# Altium schematic sheet UNDERLEGS_BULKHEAD.SchDoc: =DocumentName
size A4; Organization: Queen's Formula SAE; Address1: 130 Stuart St, Kingston; Address2: Ontario; Address3: Canada; Address4: K7L 2V9; DocumentNumber: 1; Revision: 0; SheetNumber: 1; SheetTotal: 1
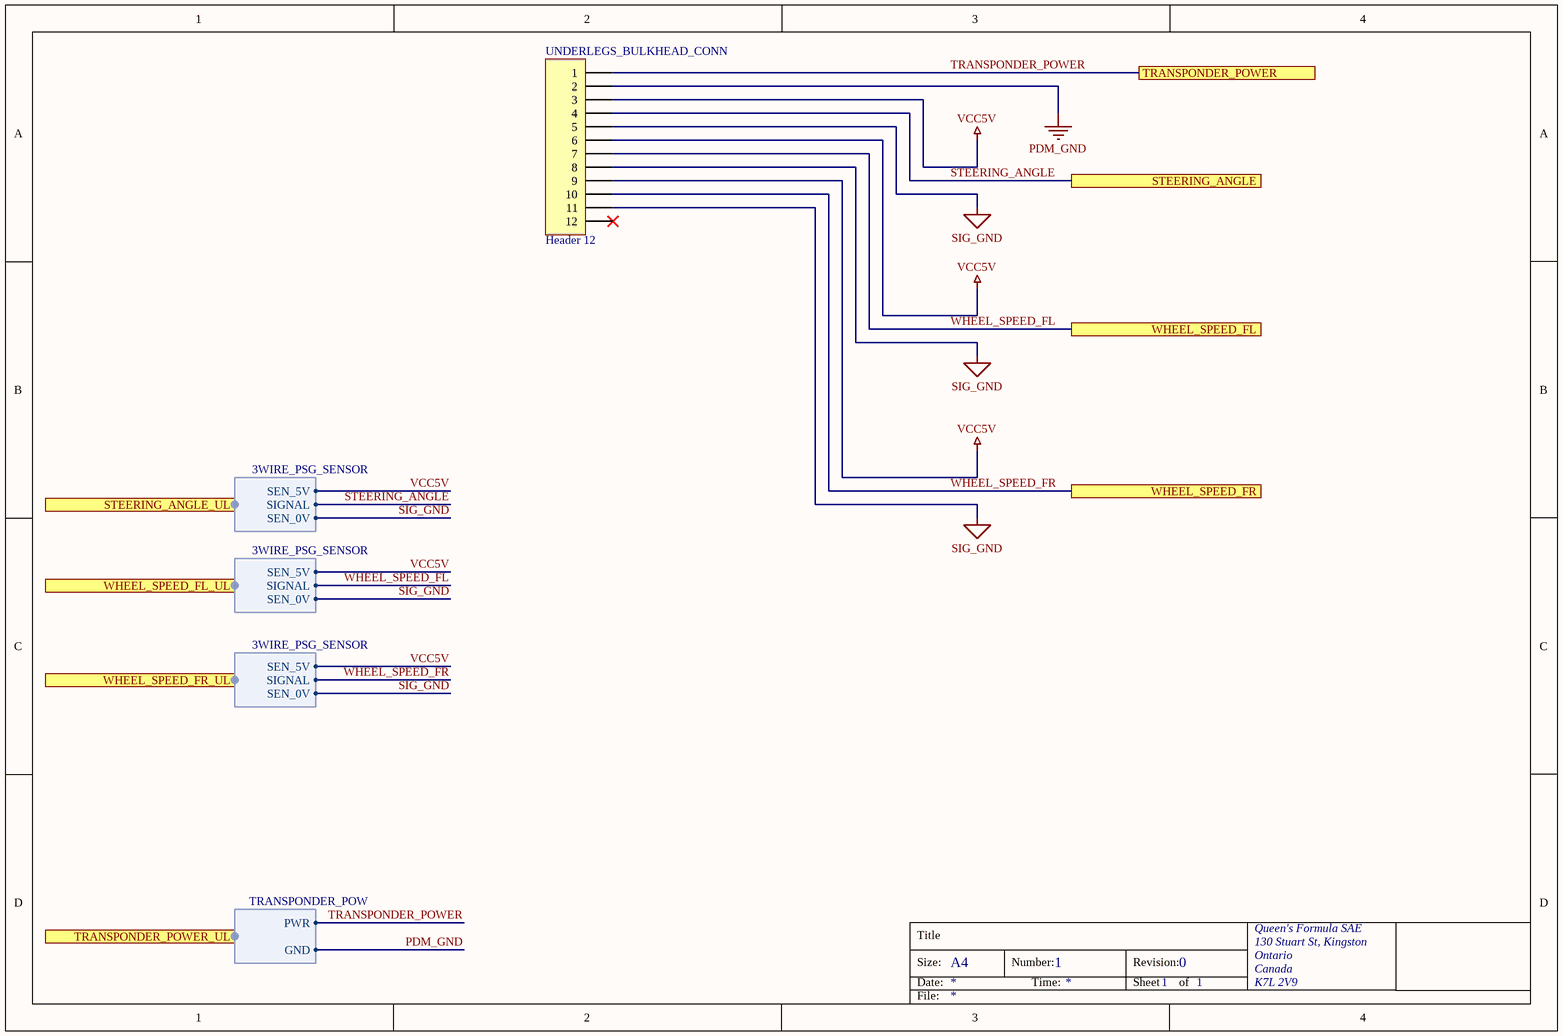
[diagram p0: UNDERLEGS_BULKHEAD.SchDoc]

## Parts
UNDERLEGS_BULKHEAD_CONN  Header 12  [HDR1X12]

## Ports
STEERING_ANGLE, STEERING_ANGLE_UL (harness 3WIRE_PSG_SENSOR), TRANSPONDER_POWER, TRANSPONDER_POWER_UL (harness TRANSPONDER_POW), WHEEL_SPEED_FL, WHEEL_SPEED_FL_UL (harness 3WIRE_PSG_SENSOR), WHEEL_SPEED_FR, WHEEL_SPEED_FR_UL (harness 3WIRE_PSG_SENSOR)

## Harnesses
3WIRE_PSG_SENSOR: SEN_5V, SEN_0V, SIGNAL
TRANSPONDER_POW: PWR, GND

## Nets
PDM_GND: UNDERLEGS_BULKHEAD_CONN.2 ; port TRANSPONDER_POWER_UL.GND
SIG_GND: UNDERLEGS_BULKHEAD_CONN.5 UNDERLEGS_BULKHEAD_CONN.8 UNDERLEGS_BULKHEAD_CONN.11 ; port WHEEL_SPEED_FL_UL.SEN_0V, port WHEEL_SPEED_FR_UL.SEN_0V, port STEERING_ANGLE_UL.SEN_0V
VCC5V: UNDERLEGS_BULKHEAD_CONN.3 UNDERLEGS_BULKHEAD_CONN.6 UNDERLEGS_BULKHEAD_CONN.9 ; port WHEEL_SPEED_FL_UL.SEN_5V, port WHEEL_SPEED_FR_UL.SEN_5V, port STEERING_ANGLE_UL.SEN_5V
STEERING_ANGLE: UNDERLEGS_BULKHEAD_CONN.4 ; port STEERING_ANGLE, port STEERING_ANGLE_UL.SIGNAL
TRANSPONDER_POWER: UNDERLEGS_BULKHEAD_CONN.1 ; port TRANSPONDER_POWER, port TRANSPONDER_POWER_UL.PWR
WHEEL_SPEED_FL: UNDERLEGS_BULKHEAD_CONN.7 ; port WHEEL_SPEED_FL, port WHEEL_SPEED_FL_UL.SIGNAL
WHEEL_SPEED_FR: UNDERLEGS_BULKHEAD_CONN.10 ; port WHEEL_SPEED_FR, port WHEEL_SPEED_FR_UL.SIGNAL

Not connected (* = marked no-connect by the designer): UNDERLEGS_BULKHEAD_CONN 12*

## Notes on the sheet
- Title
- Size:
- Date:
- A4
- Number:
- Time:
- Revision:
- Sheet
- of
- File:

## Library data of the parts
UNDERLEGS_BULKHEAD_CONN = Header 12: Header, 12-Pin; LatestRevisionDate: 17-Jul-2002; LatestRevisionNote: Re-released for DXP Platform.; Publisher: Altium Limited